# Altium schematic sheet SJA1105Q_PINOUT.SchDoc
size D; SheetNumber: 4; SheetTotal: 12
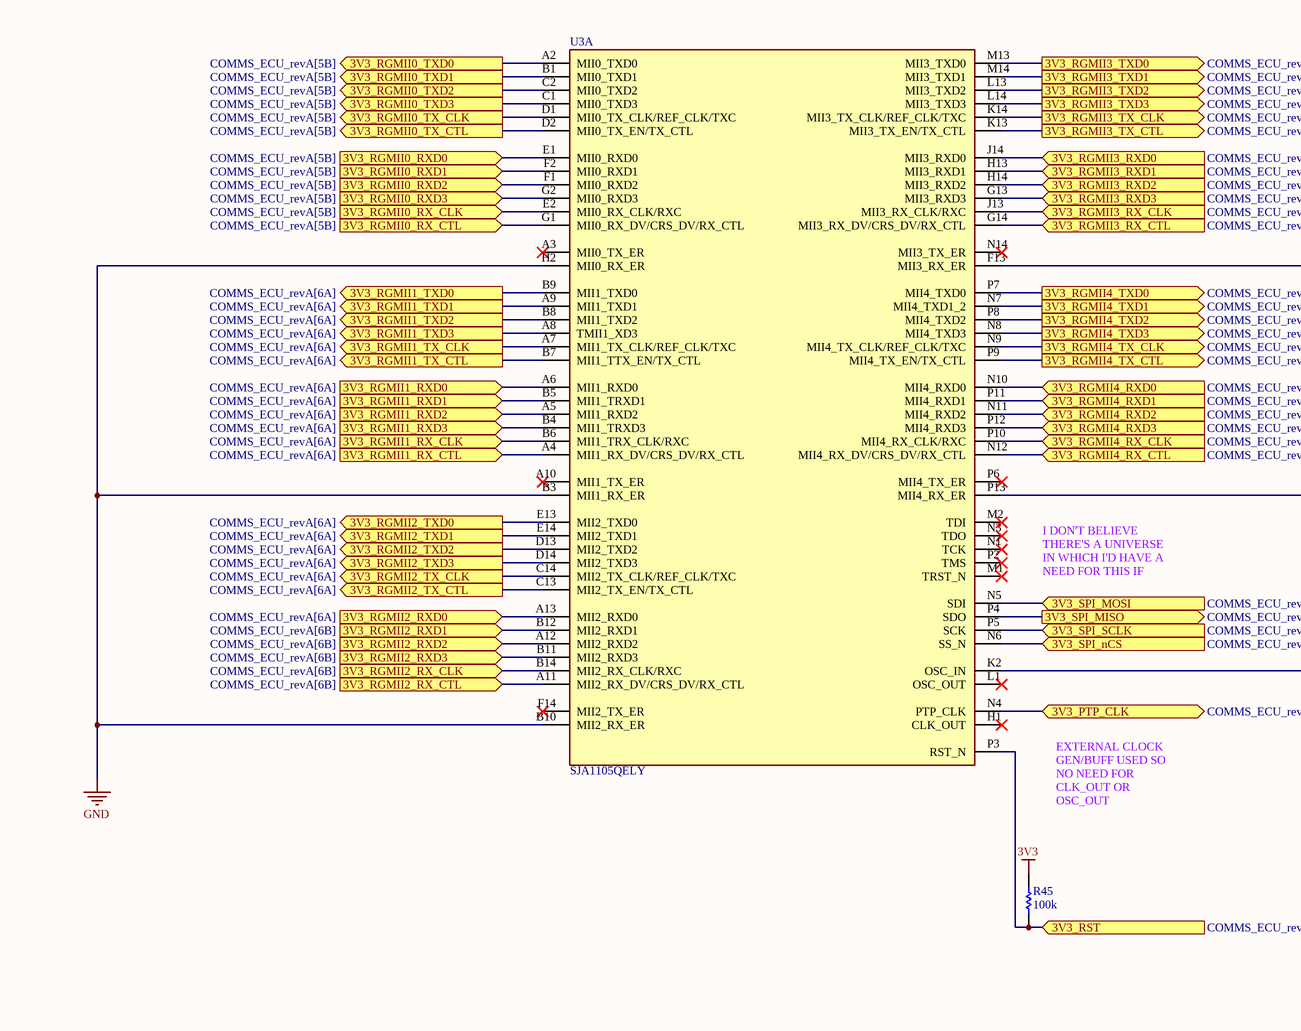
[diagram p0: SJA1105Q_PINOUT.SchDoc, top left]
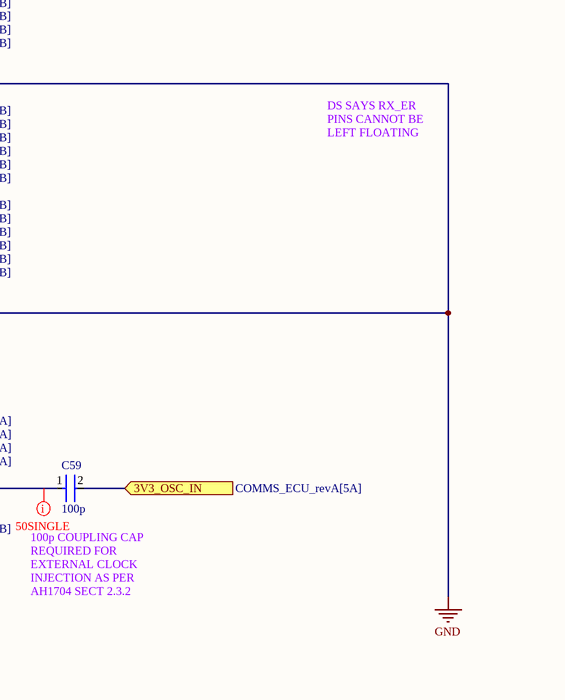
[diagram p1: SJA1105Q_PINOUT.SchDoc, top right]
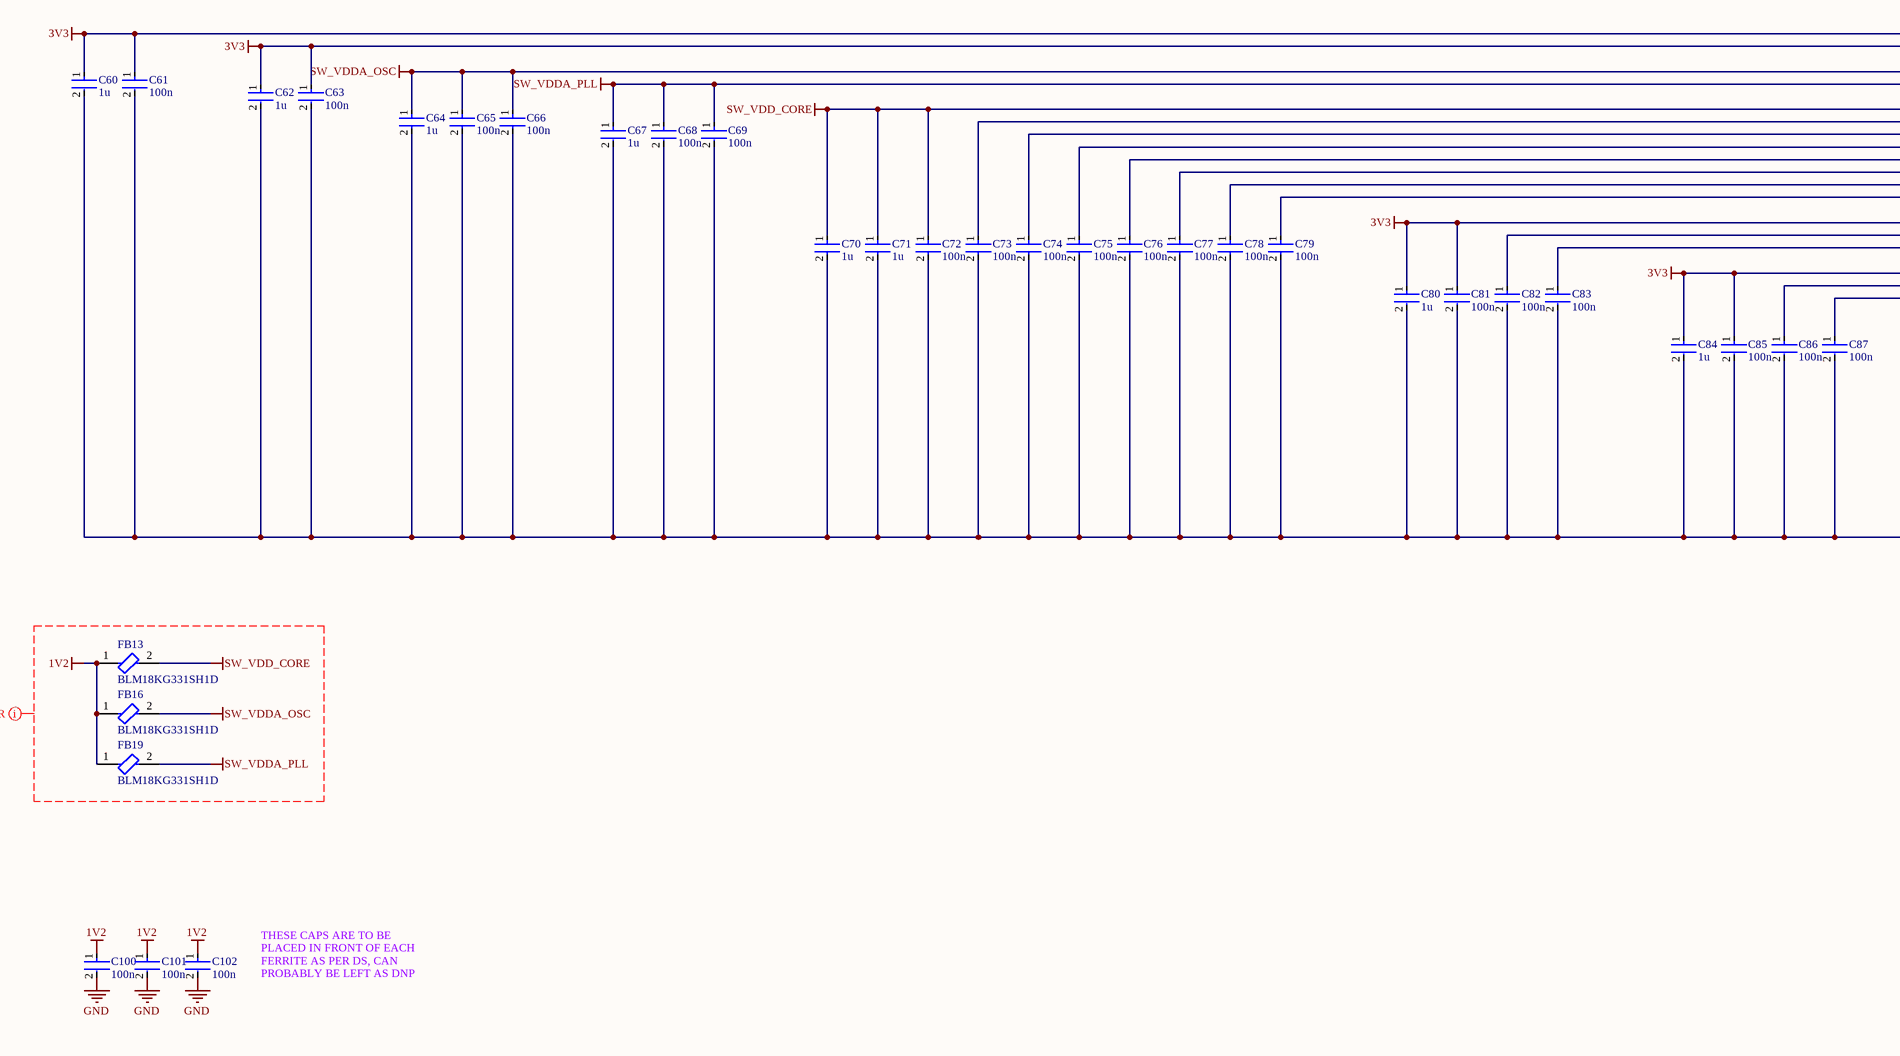
[diagram p2: SJA1105Q_PINOUT.SchDoc, bottom left]
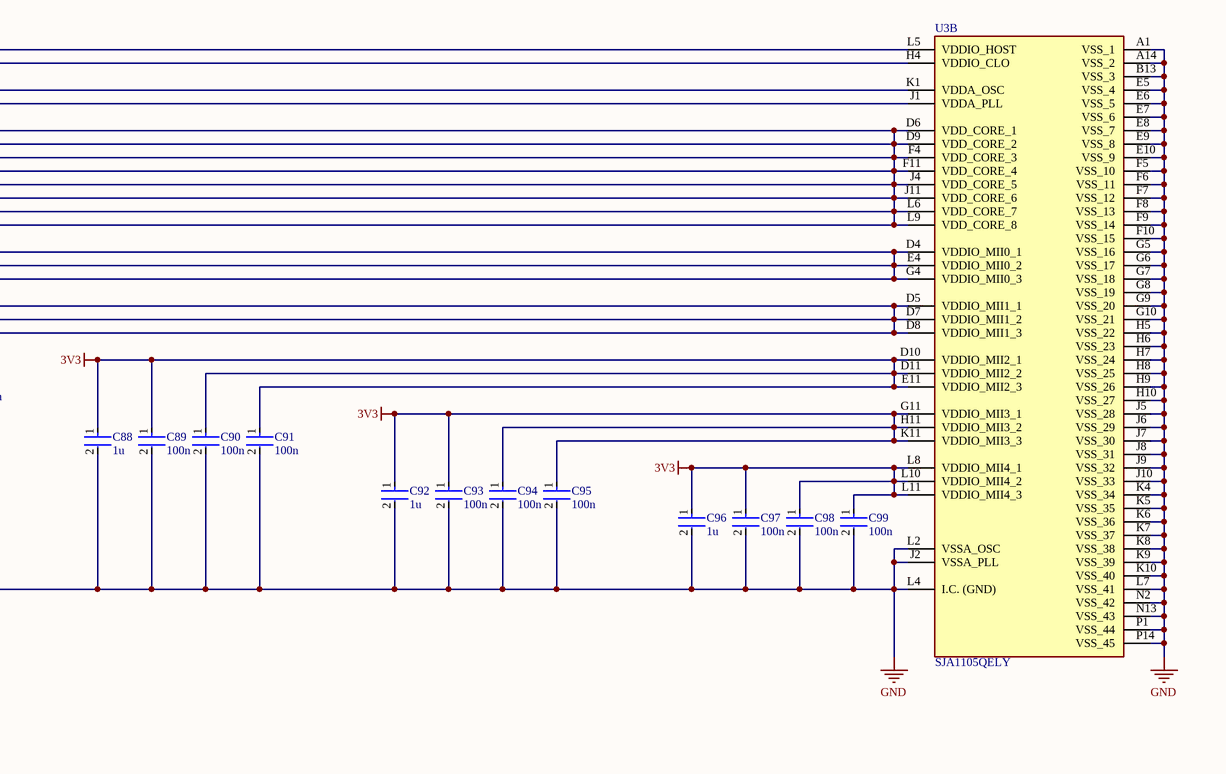
[diagram p3: SJA1105Q_PINOUT.SchDoc, bottom right]

## Parts
C59  100p  [FP-0402-L_1_0_0_05-W_0_5-IPC_A]
C60  1u  [FP-0402-L_1_0_0_05-W_0_5-IPC_A]
C61  100n  [FP-0402-L_1_0_0_05-W_0_5-IPC_A]
C62  1u  [FP-0402-L_1_0_0_05-W_0_5-IPC_A]
C63  100n  [FP-0402-L_1_0_0_05-W_0_5-IPC_A]
C64  1u  [FP-0402-L_1_0_0_05-W_0_5-IPC_A]
C65  100n  [FP-0402-L_1_0_0_05-W_0_5-IPC_A]
C66  100n  [FP-0402-L_1_0_0_05-W_0_5-IPC_A]
C67  1u  [FP-0402-L_1_0_0_05-W_0_5-IPC_A]
C68  100n  [FP-0402-L_1_0_0_05-W_0_5-IPC_A]
C69  100n  [FP-0402-L_1_0_0_05-W_0_5-IPC_A]
C70  1u  [FP-0402-L_1_0_0_05-W_0_5-IPC_A]
C71  1u  [FP-0402-L_1_0_0_05-W_0_5-IPC_A]
C72  100n  [FP-0402-L_1_0_0_05-W_0_5-IPC_A]
C73  100n  [FP-0402-L_1_0_0_05-W_0_5-IPC_A]
C74  100n  [FP-0402-L_1_0_0_05-W_0_5-IPC_A]
C75  100n  [FP-0402-L_1_0_0_05-W_0_5-IPC_A]
C76  100n  [FP-0402-L_1_0_0_05-W_0_5-IPC_A]
C77  100n  [FP-0402-L_1_0_0_05-W_0_5-IPC_A]
C78  100n  [FP-0402-L_1_0_0_05-W_0_5-IPC_A]
C79  100n  [FP-0402-L_1_0_0_05-W_0_5-IPC_A]
C80  1u  [FP-0402-L_1_0_0_05-W_0_5-IPC_A]
C81  100n  [FP-0402-L_1_0_0_05-W_0_5-IPC_A]
C82  100n  [FP-0402-L_1_0_0_05-W_0_5-IPC_A]
C83  100n  [FP-0402-L_1_0_0_05-W_0_5-IPC_A]
C84  1u  [FP-0402-L_1_0_0_05-W_0_5-IPC_A]
C85  100n  [FP-0402-L_1_0_0_05-W_0_5-IPC_A]
C86  100n  [FP-0402-L_1_0_0_05-W_0_5-IPC_A]
C87  100n  [FP-0402-L_1_0_0_05-W_0_5-IPC_A]
C88  1u  [FP-0402-L_1_0_0_05-W_0_5-IPC_A]
C89  100n  [FP-0402-L_1_0_0_05-W_0_5-IPC_A]
C90  100n  [FP-0402-L_1_0_0_05-W_0_5-IPC_A]
C91  100n  [FP-0402-L_1_0_0_05-W_0_5-IPC_A]
C92  1u  [FP-0402-L_1_0_0_05-W_0_5-IPC_A]
C93  100n  [FP-0402-L_1_0_0_05-W_0_5-IPC_A]
C94  100n  [FP-0402-L_1_0_0_05-W_0_5-IPC_A]
C95  100n  [FP-0402-L_1_0_0_05-W_0_5-IPC_A]
C96  1u  [FP-0402-L_1_0_0_05-W_0_5-IPC_A]
C97  100n  [FP-0402-L_1_0_0_05-W_0_5-IPC_A]
C98  100n  [FP-0402-L_1_0_0_05-W_0_5-IPC_A]
C99  100n  [FP-0402-L_1_0_0_05-W_0_5-IPC_A]
C100  100n  [FP-0402-L_1_0_0_05-W_0_5-IPC_A]
C101  100n  [FP-0402-L_1_0_0_05-W_0_5-IPC_A]
C102  100n  [FP-0402-L_1_0_0_05-W_0_5-IPC_A]
FB13  BLM18KG331SH1D  [FP-BLM18-0_15-t0_8-IPC_B]
FB16  BLM18KG331SH1D  [FP-BLM18-0_15-t0_8-IPC_B]
FB19  BLM18KG331SH1D  [FP-BLM18-0_15-t0_8-IPC_B]
R45  100k  [R0603B]
U3  SJA1105QELY  [SJA1105QELY-Footprint-1]  (parts A,B of 2)

## Ports
3V3_OSC_IN (in, see COMMS_ECU_revA[5A]), 3V3_PTP_CLK (bidir, see COMMS_ECU_revA[5B]), 3V3_RGMII0_RX_CLK (in, see COMMS_ECU_revA[5B]), 3V3_RGMII0_RX_CTL (in, see COMMS_ECU_revA[5B]), 3V3_RGMII0_RXD0 (in, see COMMS_ECU_revA[5B]), 3V3_RGMII0_RXD1 (in, see COMMS_ECU_revA[5B]), 3V3_RGMII0_RXD2 (in, see COMMS_ECU_revA[5B]), 3V3_RGMII0_RXD3 (in, see COMMS_ECU_revA[5B]), 3V3_RGMII0_TX_CLK (out, see COMMS_ECU_revA[5B]), 3V3_RGMII0_TX_CTL (out, see COMMS_ECU_revA[5B]), 3V3_RGMII0_TXD0 (out, see COMMS_ECU_revA[5B]), 3V3_RGMII0_TXD1 (out, see COMMS_ECU_revA[5B]), 3V3_RGMII0_TXD2 (out, see COMMS_ECU_revA[5B]), 3V3_RGMII0_TXD3 (out, see COMMS_ECU_revA[5B]), 3V3_RGMII1_RX_CLK (in, see COMMS_ECU_revA[6A]), 3V3_RGMII1_RX_CTL (in, see COMMS_ECU_revA[6A]), 3V3_RGMII1_RXD0 (in, see COMMS_ECU_revA[6A]), 3V3_RGMII1_RXD1 (in, see COMMS_ECU_revA[6A]), 3V3_RGMII1_RXD2 (in, see COMMS_ECU_revA[6A]), 3V3_RGMII1_RXD3 (in, see COMMS_ECU_revA[6A]), 3V3_RGMII1_TX_CLK (out, see COMMS_ECU_revA[6A]), 3V3_RGMII1_TX_CTL (out, see COMMS_ECU_revA[6A]), 3V3_RGMII1_TXD0 (out, see COMMS_ECU_revA[6A]), 3V3_RGMII1_TXD1 (out, see COMMS_ECU_revA[6A]), 3V3_RGMII1_TXD2 (out, see COMMS_ECU_revA[6A]), 3V3_RGMII1_TXD3 (out, see COMMS_ECU_revA[6A]), 3V3_RGMII2_RX_CLK (in, see COMMS_ECU_revA[6B]), 3V3_RGMII2_RX_CTL (in, see COMMS_ECU_revA[6B]), 3V3_RGMII2_RXD0 (in, see COMMS_ECU_revA[6A]), 3V3_RGMII2_RXD1 (in, see COMMS_ECU_revA[6B]), 3V3_RGMII2_RXD2 (in, see COMMS_ECU_revA[6B]), 3V3_RGMII2_RXD3 (in, see COMMS_ECU_revA[6B]), 3V3_RGMII2_TX_CLK (out, see COMMS_ECU_revA[6A]), 3V3_RGMII2_TX_CTL (out, see COMMS_ECU_revA[6A]), 3V3_RGMII2_TXD0 (out, see COMMS_ECU_revA[6A]), 3V3_RGMII2_TXD1 (out, see COMMS_ECU_revA[6A]), 3V3_RGMII2_TXD2 (out, see COMMS_ECU_revA[6A]), 3V3_RGMII2_TXD3 (out, see COMMS_ECU_revA[6A]), 3V3_RGMII3_RX_CLK (in, see COMMS_ECU_revA[6B]), 3V3_RGMII3_RX_CTL (in, see COMMS_ECU_revA[6B]), 3V3_RGMII3_RXD0 (in, see COMMS_ECU_revA[6B]), 3V3_RGMII3_RXD1 (in, see COMMS_ECU_revA[6B]), 3V3_RGMII3_RXD2 (in, see COMMS_ECU_revA[6B]), 3V3_RGMII3_RXD3 (in, see COMMS_ECU_revA[6B]), 3V3_RGMII3_TX_CLK (out, see COMMS_ECU_revA[6B]), 3V3_RGMII3_TX_CTL (out, see COMMS_ECU_revA[6B]), 3V3_RGMII3_TXD0 (out, see COMMS_ECU_revA[6B]), 3V3_RGMII3_TXD1 (out, see COMMS_ECU_revA[6B]), 3V3_RGMII3_TXD2 (out, see COMMS_ECU_revA[6B]), 3V3_RGMII3_TXD3 (out, see COMMS_ECU_revA[6B]), 3V3_RGMII4_RX_CLK (in, see COMMS_ECU_revA[6B]), 3V3_RGMII4_RX_CTL (in, see COMMS_ECU_revA[6B]), 3V3_RGMII4_RXD0 (in, see COMMS_ECU_revA[6B]), 3V3_RGMII4_RXD1 (in, see COMMS_ECU_revA[6B]), 3V3_RGMII4_RXD2 (in, see COMMS_ECU_revA[6B]), 3V3_RGMII4_RXD3 (in, see COMMS_ECU_revA[6B]), 3V3_RGMII4_TX_CLK (out, see COMMS_ECU_revA[6B]), 3V3_RGMII4_TX_CTL (out, see COMMS_ECU_revA[6B]), 3V3_RGMII4_TXD0 (out, see COMMS_ECU_revA[6B]), 3V3_RGMII4_TXD1 (out, see COMMS_ECU_revA[6B]), 3V3_RGMII4_TXD2 (out, see COMMS_ECU_revA[6B]), 3V3_RGMII4_TXD3 (out, see COMMS_ECU_revA[6B]), 3V3_RST (in, see COMMS_ECU_revA[5A]), 3V3_SPI_MISO (out, see COMMS_ECU_revA[5A]), 3V3_SPI_MOSI (in, see COMMS_ECU_revA[5A]), 3V3_SPI_nCS (in, see COMMS_ECU_revA[5A]), 3V3_SPI_SCLK (in, see COMMS_ECU_revA[5A])

## Nets
1V2: C100.1 C101.1 C102.1 FB13.1 FB16.1 FB19.1
3V3: C60.1 C61.1 C62.1 C63.1 C80.1 C81.1 C82.1 C83.1 C84.1 C85.1 C86.1 C87.1 C88.1 C89.1 C90.1 C91.1 C92.1 C93.1 C94.1 C95.1 C96.1 C97.1 C98.1 C99.1 R45.2 U3.D4(VDDIO_MII0_1) U3.D5(VDDIO_MII1_1) U3.D7(VDDIO_MII1_2) U3.D8(VDDIO_MII1_3) U3.D10(VDDIO_MII2_1) U3.D11(VDDIO_MII2_2) U3.E4(VDDIO_MII0_2) U3.E11(VDDIO_MII2_3) U3.G4(VDDIO_MII0_3) U3.G11(VDDIO_MII3_1) U3.H4(VDDIO_CLO) U3.H11(VDDIO_MII3_2) U3.K11(VDDIO_MII3_3) U3.L5(VDDIO_HOST) U3.L8(VDDIO_MII4_1) U3.L10(VDDIO_MII4_2) U3.L11(VDDIO_MII4_3)
GND: C60.2 C61.2 C62.2 C63.2 C64.2 C65.2 C66.2 C67.2 C68.2 C69.2 C70.2 C71.2 C72.2 C73.2 C74.2 C75.2 C76.2 C77.2 C78.2 C79.2 C80.2 C81.2 C82.2 C83.2 C84.2 C85.2 C86.2 C87.2 C88.2 C89.2 C90.2 C91.2 C92.2 C93.2 C94.2 C95.2 C96.2 C97.2 C98.2 C99.2 C100.2 C101.2 C102.2 U3.A1(VSS_1) U3.A14(VSS_2) U3.B3(MII1_RX_ER) U3.B10(MII2_RX_ER) U3.B13(VSS_3) U3.E5(VSS_4) U3.E6(VSS_5) U3.E7(VSS_6) U3.E8(VSS_7) U3.E9(VSS_8) U3.E10(VSS_9) U3.F5(VSS_10) U3.F6(VSS_11) U3.F7(VSS_12) U3.F8(VSS_13) U3.F9(VSS_14) U3.F10(VSS_15) U3.F13(MII3_RX_ER) U3.G5(VSS_16) U3.G6(VSS_17) U3.G7(VSS_18) U3.G8(VSS_19) U3.G9(VSS_20) U3.G10(VSS_21) U3.H2(MII0_RX_ER) U3.H5(VSS_22) U3.H6(VSS_23) U3.H7(VSS_24) U3.H8(VSS_25) U3.H9(VSS_26) U3.H10(VSS_27) U3.J2(VSSA_PLL) U3.J5(VSS_28) U3.J6(VSS_29) U3.J7(VSS_30) U3.J8(VSS_31) U3.J9(VSS_32) U3.J10(VSS_33) U3.K4(VSS_34) U3.K5(VSS_35) U3.K6(VSS_36) U3.K7(VSS_37) U3.K8(VSS_38) U3.K9(VSS_39) U3.K10(VSS_40) U3.L2(VSSA_OSC) U3.L4(I.C._(GND)) U3.L7(VSS_41) U3.N2(VSS_42) U3.N13(VSS_43) U3.P1(VSS_44) U3.P13(MII4_RX_ER) U3.P14(VSS_45)
SW_VDD_CORE: C70.1 C71.1 C72.1 C73.1 C74.1 C75.1 C76.1 C77.1 C78.1 C79.1 FB13.2 U3.D6(VDD_CORE_1) U3.D9(VDD_CORE_2) U3.F4(VDD_CORE_3) U3.F11(VDD_CORE_4) U3.J4(VDD_CORE_5) U3.J11(VDD_CORE_6) U3.L6(VDD_CORE_7) U3.L9(VDD_CORE_8)
SW_VDDA_OSC: C64.1 C65.1 C66.1 FB16.2 U3.K1(VDDA_OSC)
SW_VDDA_PLL: C67.1 C68.1 C69.1 FB19.2 U3.J1(VDDA_PLL)
3V3_OSC_IN: C59.2 ; port 3V3_OSC_IN
3V3_PTP_CLK: U3.N4(PTP_CLK) ; port 3V3_PTP_CLK
3V3_RGMII0_RX_CLK: U3.E2(MII0_RX_CLK/RXC) ; port 3V3_RGMII0_RX_CLK
3V3_RGMII0_RX_CTL: U3.G1(MII0_RX_DV/CRS_DV/RX_CTL) ; port 3V3_RGMII0_RX_CTL
3V3_RGMII0_RXD0: U3.E1(MII0_RXD0) ; port 3V3_RGMII0_RXD0
3V3_RGMII0_RXD1: U3.F2(MII0_RXD1) ; port 3V3_RGMII0_RXD1
3V3_RGMII0_RXD2: U3.F1(MII0_RXD2) ; port 3V3_RGMII0_RXD2
3V3_RGMII0_RXD3: U3.G2(MII0_RXD3) ; port 3V3_RGMII0_RXD3
3V3_RGMII0_TX_CLK: U3.D1(MII0_TX_CLK/REF_CLK/TXC) ; port 3V3_RGMII0_TX_CLK
3V3_RGMII0_TX_CTL: U3.D2(MII0_TX_EN/TX_CTL) ; port 3V3_RGMII0_TX_CTL
3V3_RGMII0_TXD0: U3.A2(MII0_TXD0) ; port 3V3_RGMII0_TXD0
3V3_RGMII0_TXD1: U3.B1(MII0_TXD1) ; port 3V3_RGMII0_TXD1
3V3_RGMII0_TXD2: U3.C2(MII0_TXD2) ; port 3V3_RGMII0_TXD2
3V3_RGMII0_TXD3: U3.C1(MII0_TXD3) ; port 3V3_RGMII0_TXD3
3V3_RGMII1_RX_CLK: U3.B6(MII1_TRX_CLK/RXC) ; port 3V3_RGMII1_RX_CLK
3V3_RGMII1_RX_CTL: U3.A4(MII1_RX_DV/CRS_DV/RX_CTL) ; port 3V3_RGMII1_RX_CTL
3V3_RGMII1_RXD0: U3.A6(MII1_RXD0) ; port 3V3_RGMII1_RXD0
3V3_RGMII1_RXD1: U3.B5(MII1_TRXD1) ; port 3V3_RGMII1_RXD1
3V3_RGMII1_RXD2: U3.A5(MII1_RXD2) ; port 3V3_RGMII1_RXD2
3V3_RGMII1_RXD3: U3.B4(MII1_TRXD3) ; port 3V3_RGMII1_RXD3
3V3_RGMII1_TX_CLK: U3.A7(MII1_TX_CLK/REF_CLK/TXC) ; port 3V3_RGMII1_TX_CLK
3V3_RGMII1_TX_CTL: U3.B7(MII1_TTX_EN/TX_CTL) ; port 3V3_RGMII1_TX_CTL
3V3_RGMII1_TXD0: U3.B9(MII1_TXD0) ; port 3V3_RGMII1_TXD0
3V3_RGMII1_TXD1: U3.A9(MII1_TXD1) ; port 3V3_RGMII1_TXD1
3V3_RGMII1_TXD2: U3.B8(MII1_TXD2) ; port 3V3_RGMII1_TXD2
3V3_RGMII1_TXD3: U3.A8(TMII1_XD3) ; port 3V3_RGMII1_TXD3
3V3_RGMII2_RX_CLK: U3.B14(MII2_RX_CLK/RXC) ; port 3V3_RGMII2_RX_CLK
3V3_RGMII2_RX_CTL: U3.A11(MII2_RX_DV/CRS_DV/RX_CTL) ; port 3V3_RGMII2_RX_CTL
3V3_RGMII2_RXD0: U3.A13(MII2_RXD0) ; port 3V3_RGMII2_RXD0
3V3_RGMII2_RXD1: U3.B12(MII2_RXD1) ; port 3V3_RGMII2_RXD1
3V3_RGMII2_RXD2: U3.A12(MII2_RXD2) ; port 3V3_RGMII2_RXD2
3V3_RGMII2_RXD3: U3.B11(MII2_RXD3) ; port 3V3_RGMII2_RXD3
3V3_RGMII2_TX_CLK: U3.C14(MII2_TX_CLK/REF_CLK/TXC) ; port 3V3_RGMII2_TX_CLK
3V3_RGMII2_TX_CTL: U3.C13(MII2_TX_EN/TX_CTL) ; port 3V3_RGMII2_TX_CTL
3V3_RGMII2_TXD0: U3.E13(MII2_TXD0) ; port 3V3_RGMII2_TXD0
3V3_RGMII2_TXD1: U3.E14(MII2_TXD1) ; port 3V3_RGMII2_TXD1
3V3_RGMII2_TXD2: U3.D13(MII2_TXD2) ; port 3V3_RGMII2_TXD2
3V3_RGMII2_TXD3: U3.D14(MII2_TXD3) ; port 3V3_RGMII2_TXD3
3V3_RGMII3_RX_CLK: U3.J13(MII3_RX_CLK/RXC) ; port 3V3_RGMII3_RX_CLK
3V3_RGMII3_RX_CTL: U3.G14(MII3_RX_DV/CRS_DV/RX_CTL) ; port 3V3_RGMII3_RX_CTL
3V3_RGMII3_RXD0: U3.J14(MII3_RXD0) ; port 3V3_RGMII3_RXD0
3V3_RGMII3_RXD1: U3.H13(MII3_RXD1) ; port 3V3_RGMII3_RXD1
3V3_RGMII3_RXD2: U3.H14(MII3_RXD2) ; port 3V3_RGMII3_RXD2
3V3_RGMII3_RXD3: U3.G13(MII3_RXD3) ; port 3V3_RGMII3_RXD3
3V3_RGMII3_TX_CLK: U3.K14(MII3_TX_CLK/REF_CLK/TXC) ; port 3V3_RGMII3_TX_CLK
3V3_RGMII3_TX_CTL: U3.K13(MII3_TX_EN/TX_CTL) ; port 3V3_RGMII3_TX_CTL
3V3_RGMII3_TXD0: U3.M13(MII3_TXD0) ; port 3V3_RGMII3_TXD0
3V3_RGMII3_TXD1: U3.M14(MII3_TXD1) ; port 3V3_RGMII3_TXD1
3V3_RGMII3_TXD2: U3.L13(MII3_TXD2) ; port 3V3_RGMII3_TXD2
3V3_RGMII3_TXD3: U3.L14(MII3_TXD3) ; port 3V3_RGMII3_TXD3
3V3_RGMII4_RX_CLK: U3.P10(MII4_RX_CLK/RXC) ; port 3V3_RGMII4_RX_CLK
3V3_RGMII4_RX_CTL: U3.N12(MII4_RX_DV/CRS_DV/RX_CTL) ; port 3V3_RGMII4_RX_CTL
3V3_RGMII4_RXD0: U3.N10(MII4_RXD0) ; port 3V3_RGMII4_RXD0
3V3_RGMII4_RXD1: U3.P11(MII4_RXD1) ; port 3V3_RGMII4_RXD1
3V3_RGMII4_RXD2: U3.N11(MII4_RXD2) ; port 3V3_RGMII4_RXD2
3V3_RGMII4_RXD3: U3.P12(MII4_RXD3) ; port 3V3_RGMII4_RXD3
3V3_RGMII4_TX_CLK: U3.N9(MII4_TX_CLK/REF_CLK/TXC) ; port 3V3_RGMII4_TX_CLK
3V3_RGMII4_TX_CTL: U3.P9(MII4_TX_EN/TX_CTL) ; port 3V3_RGMII4_TX_CTL
3V3_RGMII4_TXD0: U3.P7(MII4_TXD0) ; port 3V3_RGMII4_TXD0
3V3_RGMII4_TXD1: U3.N7(MII4_TXD1_2) ; port 3V3_RGMII4_TXD1
3V3_RGMII4_TXD2: U3.P8(MII4_TXD2) ; port 3V3_RGMII4_TXD2
3V3_RGMII4_TXD3: U3.N8(MII4_TXD3) ; port 3V3_RGMII4_TXD3
3V3_RST: R45.1 U3.P3(RST_N) ; port 3V3_RST
3V3_SPI_MISO: U3.P4(SDO) ; port 3V3_SPI_MISO
3V3_SPI_MOSI: U3.N5(SDI) ; port 3V3_SPI_MOSI
3V3_SPI_nCS: U3.N6(SS_N) ; port 3V3_SPI_nCS
3V3_SPI_SCLK: U3.P5(SCK) ; port 3V3_SPI_SCLK
NetC59_1: C59.1 U3.K2(OSC_IN)

Not connected (* = marked no-connect by the designer): U3 A3(MII0_TX_ER)* A10(MII1_TX_ER)* F14(MII2_TX_ER)* H1(CLK_OUT)* L1(OSC_OUT)* M1(TRST_N)* M2(TDI)* N1(TCK)* N3(TDO)* N14(MII3_TX_ER)* P2(TMS)* P6(MII4_TX_ER)*

## Layout directives
net class PWR: 1V2, SW_VDD_CORE, SW_VDDA_OSC, SW_VDDA_PLL
net class 50SINGLE: NetC59_1

## Notes on the sheet
- DS SAYS RX_ER PINS CANNOT BE LEFT FLOATING
- I DON'T BELIEVE THERE'S A UNIVERSE IN WHICH I'D HAVE A NEED FOR THIS IF
- EXTERNAL CLOCK GEN/BUFF USED SO NO NEED FOR CLK_OUT OR OSC_OUT
- (near C59) 100p COUPLING CAP REQUIRED FOR EXTERNAL CLOCK INJECTION AS PER AH1704 SECT 2.3.2
- THESE CAPS ARE TO BE PLACED IN FRONT OF EACH FERRITE AS PER DS, CAN PROBABLY BE LEFT AS DNP THO

## Library data of the parts
C59-C102 = CMP-001-00058-1: LARGE PADS, 0402 CAP, CHANGE COMMENT TO MATCH REAL P/N; Capacitor Type: Ceramic; Min Operating Temperature: -55°C; Mounting Technology: Surface Mount; Pins: 2; Case/Package: 0402; RoHS Compliant: Yes; Max Operating Temperature: 85°C
FB13 FB16 FB19 = CMP-06046-002069-1: Chip Ferrite Bead, 0603, 330Ω @ 100MHz, 0.08Ω, 25%, 1.7A; Number of Lines: 1; DC Resistance (DCR): 80mR; Packaging: Tape and Reel; Case/Package: 0603; Height: 0.037inch; Case Code (Metric): 1608; Length: 0.063inch; Package Quantity: 4000; Max Operating Temperature: 125°C; Case Code (Imperial): 0603; RoHS Compliant: Yes; Width: 0.032inch; Mount: Surface Mount; Min Operating Temperature: -55°C; Ratings: AEC-Q200; Max Current Rating: 1.7A
R45 = CMP-009-00002-14: Resistor; Value: 100k
U3 = CMP-015-00025-2: Ethernet Controller, Ethernet Switch, IEEE 802.3, 1.2 V, LFBGA, 159 Pins; Min Operating Temperature: -40°C; Max Operating Temperature: 105°C